# Altium schematic sheet Cover Sheet.SchDoc
size B; SheetNumber: 1; SheetTotal: 11; TitleBlk1Sch: PCBA, LUCHADOR, REV 3.2b, AMBER; TitleBlk2Sch: Luchador System; RevSch: 01; EngDate: 3-15-2019; Eng: Haman/Seto
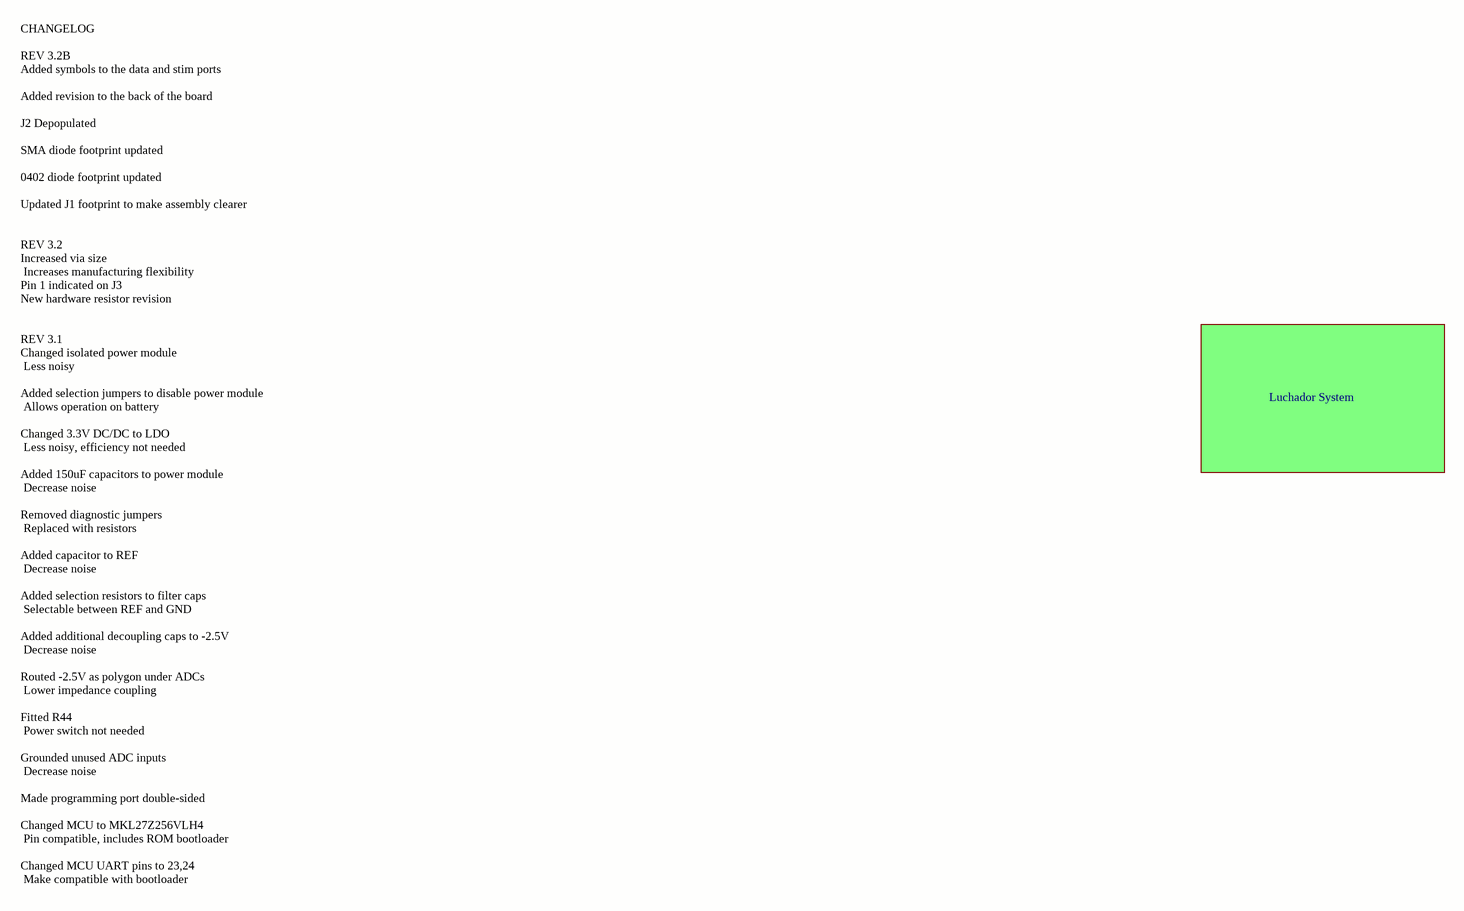
[diagram p0: Cover Sheet.SchDoc]

## Sub-sheets
Luchador System = System.SchDoc: no entries

## Notes on the sheet
- CHANGELOG
  REV 3.2B
  Added symbols to the data and stim ports
  Added revision to the back of the board
  J2 Depopulated
  SMA diode footprint updated
  0402 diode footprint updated
  Updated J1 footprint to make assembly clearer
  REV 3.2
  Increased via size
  Increases manufacturing flexibility
  Pin 1 indicated on J3
  New hardware resistor revision
  REV 3.1
  Changed isolated power module
  Less noisy
  Added selection jumpers to disable power module
  Allows operation on battery
  Changed 3.3V DC/DC to LDO
  Less noisy, efficiency not needed
  Added 150uF capacitors to power module
  Decrease noise
  Removed diagnostic jumpers
  Replaced with resistors
  Added capacitor to REF
  Decrease noise
  Added selection resistors to filter caps
  Selectable between REF and GND
  Added additional decoupling caps to -2.5V
  Decrease noise
  Routed -2.5V as polygon under ADCs
  Lower impedance coupling
  Fitted R44
  Power switch not needed
  Grounded unused ADC inputs
  Decrease noise
  Made programming port double-sided
  Changed MCU to MKL27Z256VLH4
  Pin compatible, includes ROM bootloader
  Changed MCU UART pins to 23,24
  Make compatible with bootloader
  Moved START signal to pin 41
  Original pin was NMI pin
  Added MCU hardware version resistors
  Added force bootloader jumper
  Allows image update without JTAG
  REV 3.0
  New Release
- Title:
- USA
- 100 Mayfield Avenue
- Mountain View, CA 94043
- Variant Name:
- Confidential and Proprietary
- Engineer:
- Date:
- Size:
- B
- Template:
- 992-00283-00 A
- Dwg No:
- Sheet:
- Rev:
- of